# Altium project BRZ_LightLink_V2.PrjPcb
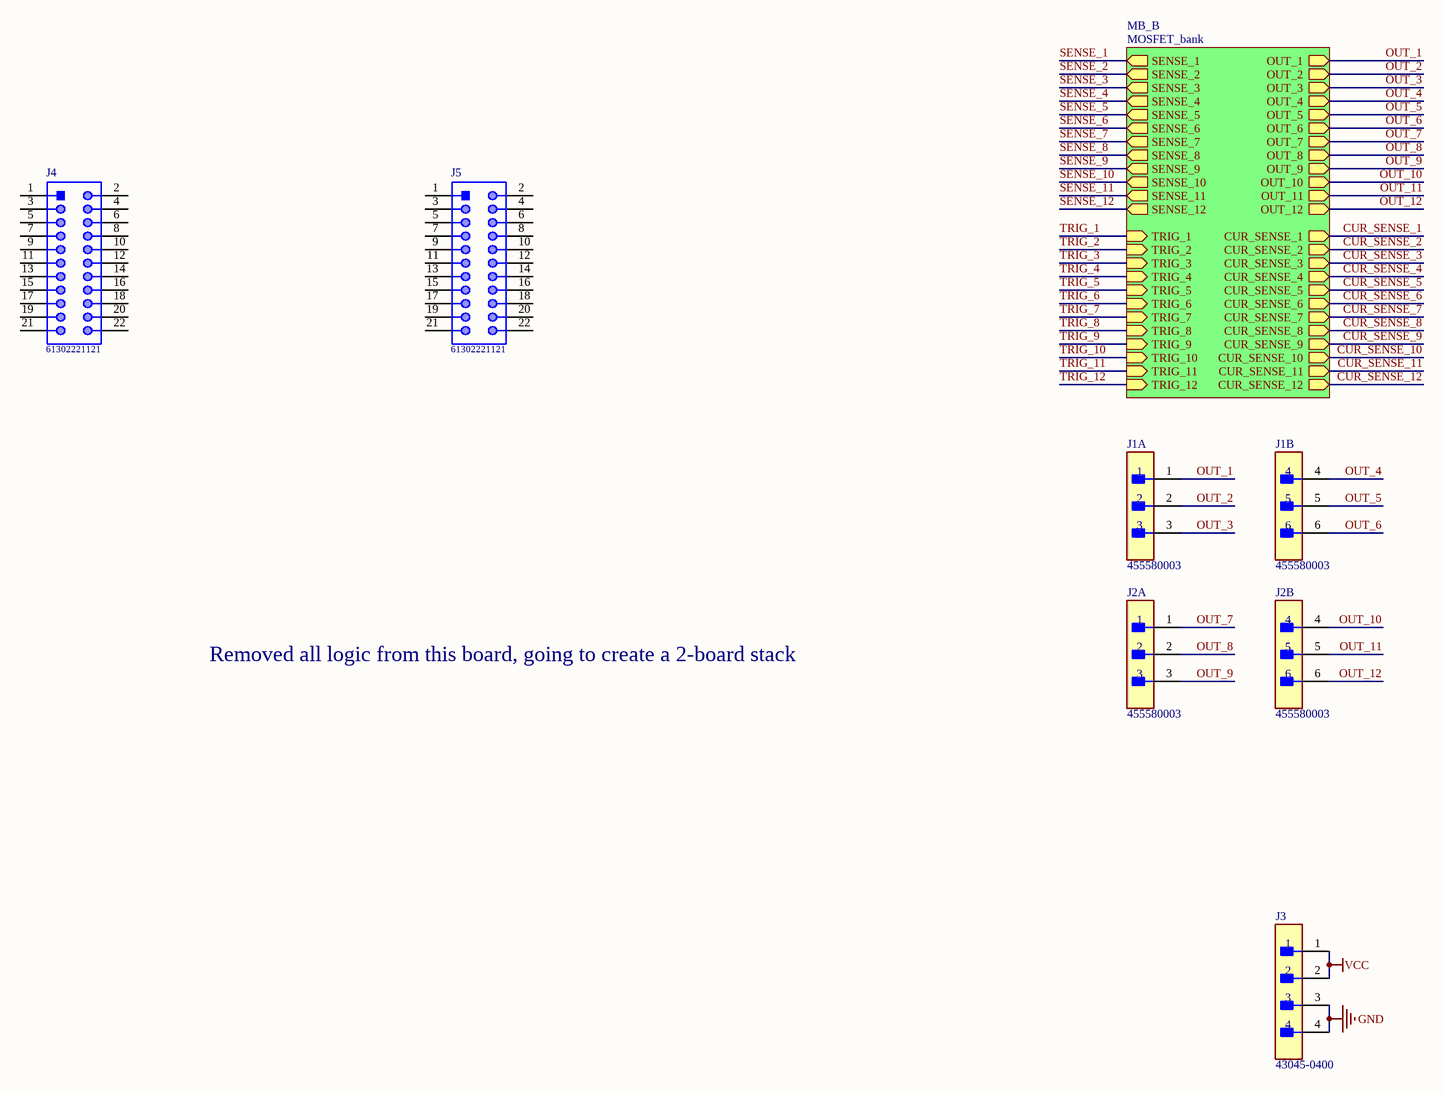
[diagram p0: LightLinkV2.SchDoc]
3 sheets, 269 parts. Net scope: hierarchical (ports join the sheet entries above them; power ports are global).
Board file: LightLinkV2.PcbDoc
Sheets:
  LightLinkV2.SchDoc
    MB_B = MOSFET_bank.SchDoc
      M = MOSFET.SchDoc
      M = MOSFET.SchDoc
      M = MOSFET.SchDoc
      M = MOSFET.SchDoc
      M = MOSFET.SchDoc
      M = MOSFET.SchDoc
      M = MOSFET.SchDoc
      M = MOSFET.SchDoc
      M = MOSFET.SchDoc
      M = MOSFET.SchDoc
      M = MOSFET.SchDoc
      M = MOSFET.SchDoc

## Sheet LightLinkV2.SchDoc
size B; SheetNumber: 1; SheetTotal: 3

### Parts
J1  455580003  [FP-455580003-MFG]  (parts A,B of 2)
J2  455580003  [FP-455580003-MFG]  (parts A,B of 2)
J3  43045-0400  [FP-43045-0400-MFG]
J4  61302221121  [61302221121]
J5  61302221121  [61302221121]

### Sub-sheets
MB_B = MOSFET_bank: SENSE_1 (out), SENSE_2 (out), SENSE_3 (out), SENSE_4 (out), TRIG_1 (in), OUT_1 (out), TRIG_2 (in), OUT_2 (out), TRIG_3 (in), OUT_3 (out), TRIG_4 (in), OUT_4 (out), SENSE_5 (out), SENSE_6 (out), SENSE_7 (out), SENSE_8 (out), TRIG_5 (in), OUT_5 (out), TRIG_6 (in), OUT_6 (out), TRIG_7 (in), OUT_7 (out), TRIG_8 (in), OUT_8 (out), SENSE_9 (out), SENSE_10 (out), SENSE_11 (out), SENSE_12 (out), TRIG_9 (in), OUT_9 (out), TRIG_10 (in), OUT_10 (out), TRIG_11 (in), OUT_11 (out), TRIG_12 (in), OUT_12 (out), CUR_SENSE_1 (out), CUR_SENSE_2 (out), CUR_SENSE_3 (out), CUR_SENSE_4 (out), CUR_SENSE_5 (out), CUR_SENSE_6 (out), CUR_SENSE_12 (out), CUR_SENSE_11 (out), CUR_SENSE_10 (out), CUR_SENSE_9 (out), CUR_SENSE_8 (out), CUR_SENSE_7 (out)

### Nets
GND: J3.3 J3.4
VCC: J3.1 J3.2
OUT_1: J1.1 ; sheet MB_B/OUT_1
OUT_2: J1.2 ; sheet MB_B/OUT_2
OUT_3: J1.3 ; sheet MB_B/OUT_3
OUT_4: J1.4 ; sheet MB_B/OUT_4
OUT_5: J1.5 ; sheet MB_B/OUT_5
OUT_6: J1.6 ; sheet MB_B/OUT_6
OUT_7: J2.1 ; sheet MB_B/OUT_7
OUT_8: J2.2 ; sheet MB_B/OUT_8
OUT_9: J2.3 ; sheet MB_B/OUT_9
OUT_10: J2.4 ; sheet MB_B/OUT_10
OUT_11: J2.5 ; sheet MB_B/OUT_11
OUT_12: J2.6 ; sheet MB_B/OUT_12

Not connected (* = marked no-connect by the designer): J4 1 2 3 4 5 6 7 8 9 10 11 12 13 14 15 16 17 18 19 20 21 22; J5 1 2 3 4 5 6 7 8 9 10 11 12 13 14 15 16 17 18 19 20 21 22

### Notes on the sheet
- Removed all logic from this board, going to create a 2-board stack

### Library data of the parts
J1 J2 = CMP-04776-000024-1: CONN HEADER R/A 6POS 4.2MM; Manufacturer: Molex; Standoff Height: 0.4mm; Conn Orientation: Right Angle; Number Of Contacts: 6; Conn Gender: Male; Voltage Rating: 600V; Current Rating: 8A; Footprint Url: https://www.molex.com/pdm_docs/sd/455580003_sd.pdf; Number Of Rows: 2; Lead Free: Yes; Digikey Description: CONN HEADER R/A 6POS 4.2MM; ComponentLink2URL: https://www.molex.com/webdocs/datasheets/pdf/en-us/0455580003_PCB_HEADERS.pdf; Octopart: https://octopart.com/45558-0003-molex-7672845; Package: 0; Device Class L3: unset; ComponentLink2Description: Datasheet; Device Class L2: Headers and Wire Housings; Category: Conn; Contact Material: Tin,Nickel; Mouser Description: Conn Power HDR 6 POS 4.2mm Solder ST Thru-Hole 6 Terminal 1 Port Mini-Fit Jr™ Tray; Manufacturer Part Number: 455580003; Pitch: 4.2mm; Device Class L1: Connectors; Temperature Range Low: -40°C; Temperature: -40°C to +105°C; RoHS: TRUE; Temperature Range High: +105°C; Height: 10.38mm; Automotive: No
J3 = CMP-04776-000002-1: CONN HEADER R/A 4POS 3MM; Manufacturer: Molex; Conn Gender: Male; Conn Orientation: Right Angle; Voltage Rating: 600V; Number Of Contacts: 4; Is Female: yes; Current Rating: 8.5A; ComponentLink2URL: https://www.molex.com/webdocs/datasheets/pdf/en-us/0430450400_PCB_HEADERS.pdf; Manufacturer Part Number: 43045-0400; Digikey Description: CONN HEADER R/A 4POS 3MM; Category: Conn; Temperature Range High: +105°C; Lead Free: Yes; Device Class L1: Connectors; Automotive: No; Temperature: -40°C to +105°C; Footprint Url: https://www.molex.com/pdm_docs/sd/430450400_sd.pdf; Height: 9.27mm; Number Of Rows: 2; Device Class L3: unset; Pitch: 3mm; Temperature Range Low: -40°C; Contact Material: Tin,Nickel; Octopart: https://octopart.com/43045-0400-molex-287063; RoHS: TRUE; ComponentLink2Description: Datasheet; Package: 43045-0400; Device Class L2: Headers and Wire Housings
J4 J5 = CMP-1502-01108-1: THT Vertical Pin Header WR-PHD, Pitch 2.54 mm, Dual Row, 22 pins; Manufacturer: Wurth Elektronik; Working Voltage: 250VAC; Pin Number: 22; Withstanding Voltage: 500VAC; Rated Current: 3A; Contact Resistance: 20mOhm; Gender: Male; Pitch: 2.54mm; Publisher: WurthElektronik; Part Number: 61302221121; Mounting Technology: THT; Row Number: Dual; Orientation: Vertical; Operating Temperature: -40to105degC; Manufacturer URL: http://www.we-online.de; Packaging: Bag; Datasheet URL: https://katalog.we-online.de/em/datasheet/6130xx21121.pdf; Package Reference: 61302221121

## Sheet MOSFET_bank.SchDoc
size A; SheetNumber: 2; SheetTotal: 4
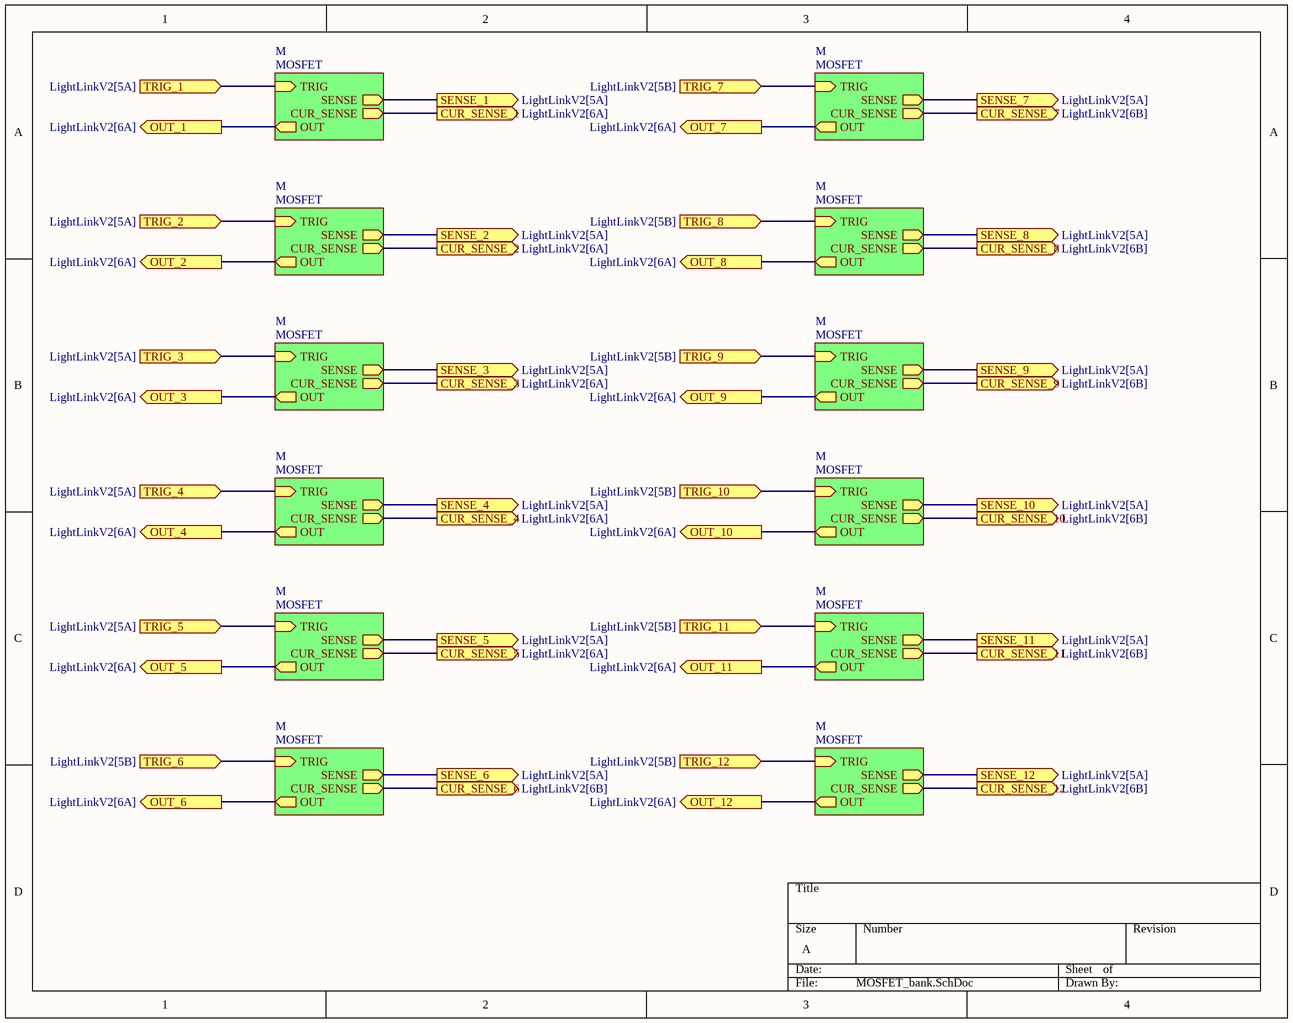
[diagram p1: MOSFET_bank.SchDoc]

### Sub-sheets
M = MOSFET: TRIG (in), OUT (out), SENSE (out), CUR_SENSE (out)
M = MOSFET: TRIG (in), OUT (out), SENSE (out), CUR_SENSE (out)
M = MOSFET: TRIG (in), OUT (out), SENSE (out), CUR_SENSE (out)
M = MOSFET: TRIG (in), OUT (out), SENSE (out), CUR_SENSE (out)
M = MOSFET: TRIG (in), OUT (out), SENSE (out), CUR_SENSE (out)
M = MOSFET: TRIG (in), OUT (out), SENSE (out), CUR_SENSE (out)
M = MOSFET: TRIG (in), OUT (out), SENSE (out), CUR_SENSE (out)
M = MOSFET: TRIG (in), OUT (out), SENSE (out), CUR_SENSE (out)
M = MOSFET: TRIG (in), OUT (out), SENSE (out), CUR_SENSE (out)
M = MOSFET: TRIG (in), OUT (out), SENSE (out), CUR_SENSE (out)
M = MOSFET: TRIG (in), OUT (out), SENSE (out), CUR_SENSE (out)
M = MOSFET: TRIG (in), OUT (out), SENSE (out), CUR_SENSE (out)

### Ports
CUR_SENSE_1 (out, see LightLinkV2[6A]), CUR_SENSE_2 (out, see LightLinkV2[6A]), CUR_SENSE_3 (out, see LightLinkV2[6A]), CUR_SENSE_4 (out, see LightLinkV2[6A]), CUR_SENSE_5 (out, see LightLinkV2[6A]), CUR_SENSE_6 (out, see LightLinkV2[6B]), CUR_SENSE_7 (out, see LightLinkV2[6B]), CUR_SENSE_8 (out, see LightLinkV2[6B]), CUR_SENSE_9 (out, see LightLinkV2[6B]), CUR_SENSE_10 (out, see LightLinkV2[6B]), CUR_SENSE_11 (out, see LightLinkV2[6B]), CUR_SENSE_12 (out, see LightLinkV2[6B]), OUT_1 (out, see LightLinkV2[6A]), OUT_2 (out, see LightLinkV2[6A]), OUT_3 (out, see LightLinkV2[6A]), OUT_4 (out, see LightLinkV2[6A]), OUT_5 (out, see LightLinkV2[6A]), OUT_6 (out, see LightLinkV2[6A]), OUT_7 (out, see LightLinkV2[6A]), OUT_8 (out, see LightLinkV2[6A]), OUT_9 (out, see LightLinkV2[6A]), OUT_10 (out, see LightLinkV2[6A]), OUT_11 (out, see LightLinkV2[6A]), OUT_12 (out, see LightLinkV2[6A]), SENSE_1 (out, see LightLinkV2[5A]), SENSE_2 (out, see LightLinkV2[5A]), SENSE_3 (out, see LightLinkV2[5A]), SENSE_4 (out, see LightLinkV2[5A]), SENSE_5 (out, see LightLinkV2[5A]), SENSE_6 (out, see LightLinkV2[5A]), SENSE_7 (out, see LightLinkV2[5A]), SENSE_8 (out, see LightLinkV2[5A]), SENSE_9 (out, see LightLinkV2[5A]), SENSE_10 (out, see LightLinkV2[5A]), SENSE_11 (out, see LightLinkV2[5A]), SENSE_12 (out, see LightLinkV2[5A]), TRIG_1 (in, see LightLinkV2[5A]), TRIG_2 (in, see LightLinkV2[5A]), TRIG_3 (in, see LightLinkV2[5A]), TRIG_4 (in, see LightLinkV2[5A]), TRIG_5 (in, see LightLinkV2[5A]), TRIG_6 (in, see LightLinkV2[5B]), TRIG_7 (in, see LightLinkV2[5B]), TRIG_8 (in, see LightLinkV2[5B]), TRIG_9 (in, see LightLinkV2[5B]), TRIG_10 (in, see LightLinkV2[5B]), TRIG_11 (in, see LightLinkV2[5B]), TRIG_12 (in, see LightLinkV2[5B])

### Nets
CUR_SENSE_1: port CUR_SENSE_1, sheet M/CUR_SENSE
CUR_SENSE_2: port CUR_SENSE_2, sheet M/CUR_SENSE
CUR_SENSE_3: port CUR_SENSE_3, sheet M/CUR_SENSE
CUR_SENSE_4: port CUR_SENSE_4, sheet M/CUR_SENSE
CUR_SENSE_5: port CUR_SENSE_5, sheet M/CUR_SENSE
CUR_SENSE_6: port CUR_SENSE_6, sheet M/CUR_SENSE
CUR_SENSE_7: port CUR_SENSE_7, sheet M/CUR_SENSE
CUR_SENSE_8: port CUR_SENSE_8, sheet M/CUR_SENSE
CUR_SENSE_9: port CUR_SENSE_9, sheet M/CUR_SENSE
CUR_SENSE_10: port CUR_SENSE_10, sheet M/CUR_SENSE
CUR_SENSE_11: port CUR_SENSE_11, sheet M/CUR_SENSE
CUR_SENSE_12: port CUR_SENSE_12, sheet M/CUR_SENSE
OUT_1: port OUT_1, sheet M/OUT
OUT_2: port OUT_2, sheet M/OUT
OUT_3: port OUT_3, sheet M/OUT
OUT_4: port OUT_4, sheet M/OUT
OUT_5: port OUT_5, sheet M/OUT
OUT_6: port OUT_6, sheet M/OUT
OUT_7: port OUT_7, sheet M/OUT
OUT_8: port OUT_8, sheet M/OUT
OUT_9: port OUT_9, sheet M/OUT
OUT_10: port OUT_10, sheet M/OUT
OUT_11: port OUT_11, sheet M/OUT
OUT_12: port OUT_12, sheet M/OUT
SENSE_1: port SENSE_1, sheet M/SENSE
SENSE_2: port SENSE_2, sheet M/SENSE
SENSE_3: port SENSE_3, sheet M/SENSE
SENSE_4: port SENSE_4, sheet M/SENSE
SENSE_5: port SENSE_5, sheet M/SENSE
SENSE_6: port SENSE_6, sheet M/SENSE
SENSE_7: port SENSE_7, sheet M/SENSE
SENSE_8: port SENSE_8, sheet M/SENSE
SENSE_9: port SENSE_9, sheet M/SENSE
SENSE_10: port SENSE_10, sheet M/SENSE
SENSE_11: port SENSE_11, sheet M/SENSE
SENSE_12: port SENSE_12, sheet M/SENSE
TRIG_1: port TRIG_1, sheet M/TRIG
TRIG_2: port TRIG_2, sheet M/TRIG
TRIG_3: port TRIG_3, sheet M/TRIG
TRIG_4: port TRIG_4, sheet M/TRIG
TRIG_5: port TRIG_5, sheet M/TRIG
TRIG_6: port TRIG_6, sheet M/TRIG
TRIG_7: port TRIG_7, sheet M/TRIG
TRIG_8: port TRIG_8, sheet M/TRIG
TRIG_9: port TRIG_9, sheet M/TRIG
TRIG_10: port TRIG_10, sheet M/TRIG
TRIG_11: port TRIG_11, sheet M/TRIG
TRIG_12: port TRIG_12, sheet M/TRIG

## Sheet MOSFET.SchDoc
size A4; SheetNumber: 3; SheetTotal: 3
Used 12 times, as channels MB_B/M, MB_B/M, MB_B/M, MB_B/M, MB_B/M, MB_B/M, MB_B/M, MB_B/M, MB_B/M, MB_B/M, MB_B/M, MB_B/M. Parts and nets are listed once, with the designators drawn on the sheet.
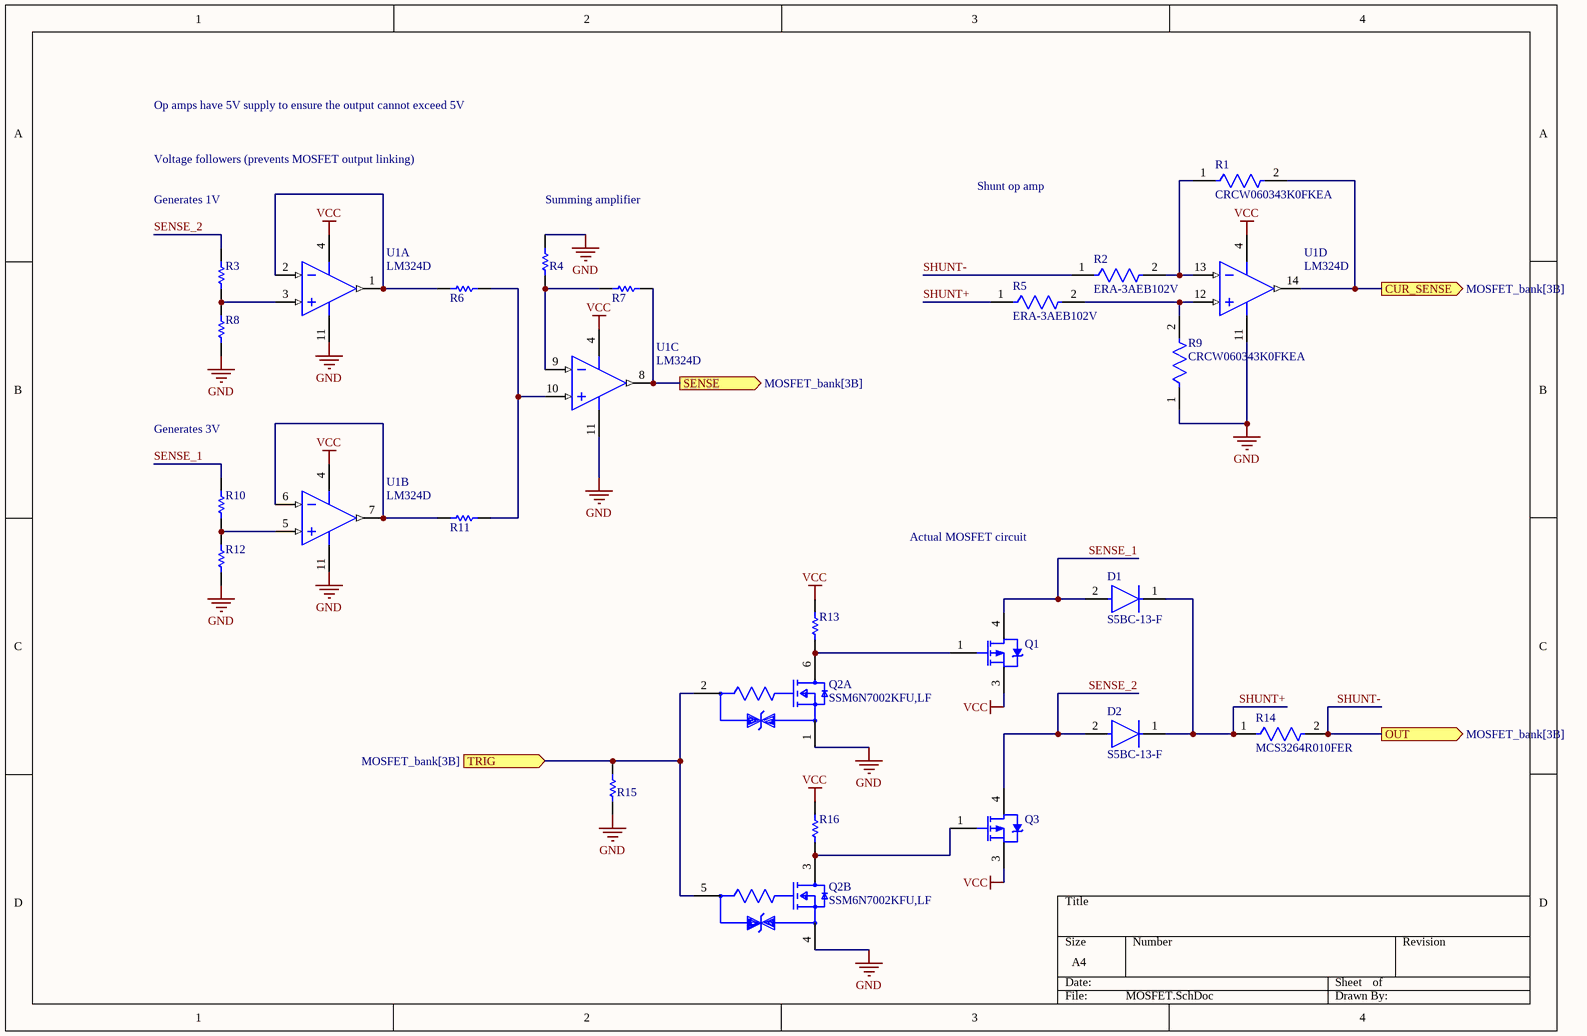
[diagram p2: MOSFET.SchDoc]

### Parts
D1  S5BC-13-F  [FP-SMC-MFG]
D2  S5BC-13-F  [FP-SMC-MFG]
Q1  NTD25P03LT4G  [ONSC-DPAK-3-369C-01_V]  (value not drawn)
Q2  SSM6N7002KFU,LF  [FP-SSOP6-P-0_65A-MFG]  (parts A,B of 2)
Q3  NTD25P03LT4G  [ONSC-DPAK-3-369C-01_V]  (value not drawn)
R1  CRCW060343K0FKEA  [FP-CRCW0603-e3-IPC_A]
R2  ERA-3AEB102V  [FP-ERA3A-IPC_C]
R3  ERJ3EKF1002V  [RESC1609X55X30LL15T15]  (value not drawn)
R4  ERJ3EKF1002V  [RESC1609X55X30LL15T15]  (value not drawn)
R5  ERA-3AEB102V  [FP-ERA3A-IPC_C]
R6  ERJ3EKF1002V  [RESC1609X55X30LL15T15]  (value not drawn)
R7  ERJ3EKF1002V  [RESC1609X55X30LL15T15]  (value not drawn)
R8  ERA-3AEB751V  [RESC1608X55X30ML20T20]  (value not drawn)
R9  CRCW060343K0FKEA  [FP-CRCW0603-e3-IPC_A]
R10  ERJ3EKF1002V  [RESC1609X55X30LL15T15]  (value not drawn)
R11  ERJ3EKF1002V  [RESC1609X55X30LL15T15]  (value not drawn)
R12  ERA3AEB242V  [RESC1608X55X30NL20T20]  (value not drawn)
R13  ERJ3EKF1002V  [RESC1609X55X30LL15T15]  (value not drawn)
R14  MCS3264R010FER  [FP-MCS3264-MFG]
R15  ERJ3EKF1002V  [RESC1609X55X30LL15T15]  (value not drawn)
R16  ERJ3EKF1002V  [RESC1609X55X30LL15T15]  (value not drawn)
U1  LM324D  [D0014A_L]  (parts A,B,C,D of 4)

### Ports
CUR_SENSE (out, see MOSFET_bank[3B]), OUT (out, see MOSFET_bank[3B]), SENSE (out, see MOSFET_bank[3B]), TRIG (in, see MOSFET_bank[3B])

### Nets
GND: Q2.1(Source1) Q2.4(Source2) R4.1 R8.1 R9.1 R12.1 R15.2 U1.11(GND)
VCC: Q1.3(S) Q3.3(S) R13.2 R16.2 U1.4(VCC)
CUR_SENSE: R1.2 U1.14(4OUT) ; port CUR_SENSE
SENSE: R7.1 U1.8(3OUT) ; port SENSE
SENSE_1: D1.2(A) Q1.4(D) R10.2
SENSE_2: D2.2(A) Q3.4(D) R3.2
SHUNT+: D1.1(C) D2.1(C) R5.1 R14.1
SHUNT-: R2.1 R14.2 ; port OUT
TRIG: Q2.2(Gate1) Q2.5(Gate2) R15.1 ; port TRIG
NetQ1_1: Q1.1(G) Q2.6(Drain1) R13.1
NetQ2_3: Q2.3(Drain2) Q3.1(G) R16.1
NetR1_1: R1.1 R2.2 U1.13(4IN-)
NetR3_1: R3.1 R8.2 U1.3(1IN+)
NetR4_2: R4.2 R7.2 U1.9(3IN-)
NetR5_2: R5.2 R9.2 U1.12(4IN+)
NetR6_1: R6.1 R11.1 U1.10(3IN+)
NetR6_2: R6.2 U1.1(1OUT) U1.2(1IN-)
NetR10_1: R10.1 R12.2 U1.5(2IN+)
NetR11_2: R11.2 U1.6(2IN-) U1.7(2OUT)

### Channels
MB_B/M: designators end in _M12; ports CUR_SENSE=CUR_SENSE_1 OUT=OUT_1 SENSE=SENSE_1 TRIG=TRIG_1
MB_B/M: designators end in _M11; ports CUR_SENSE=CUR_SENSE_2 OUT=OUT_2 SENSE=SENSE_2 TRIG=TRIG_2
MB_B/M: designators end in _M10; ports CUR_SENSE=CUR_SENSE_3 OUT=OUT_3 SENSE=SENSE_3 TRIG=TRIG_3
MB_B/M: designators end in _M9; ports CUR_SENSE=CUR_SENSE_4 OUT=OUT_4 SENSE=SENSE_4 TRIG=TRIG_4
MB_B/M: designators end in _M8; ports CUR_SENSE=CUR_SENSE_5 OUT=OUT_5 SENSE=SENSE_5 TRIG=TRIG_5
MB_B/M: designators end in _M7; ports CUR_SENSE=CUR_SENSE_6 OUT=OUT_6 SENSE=SENSE_6 TRIG=TRIG_6
MB_B/M: designators end in _M6; ports CUR_SENSE=CUR_SENSE_7 OUT=OUT_7 SENSE=SENSE_7 TRIG=TRIG_7
MB_B/M: designators end in _M5; ports CUR_SENSE=CUR_SENSE_8 OUT=OUT_8 SENSE=SENSE_8 TRIG=TRIG_8
MB_B/M: designators end in _M4; ports CUR_SENSE=CUR_SENSE_9 OUT=OUT_9 SENSE=SENSE_9 TRIG=TRIG_9
MB_B/M: designators end in _M3; ports CUR_SENSE=CUR_SENSE_10 OUT=OUT_10 SENSE=SENSE_10 TRIG=TRIG_10
MB_B/M: designators end in _M2; ports CUR_SENSE=CUR_SENSE_11 OUT=OUT_11 SENSE=SENSE_11 TRIG=TRIG_11
MB_B/M: designators end in _M1; ports CUR_SENSE=CUR_SENSE_12 OUT=OUT_12 SENSE=SENSE_12 TRIG=TRIG_12

### Notes on the sheet
- Op amps have 5V supply to ensure the output cannot exceed 5V
- Voltage followers (prevents MOSFET output linking)
- Generates 1V
- (near R4) Summing amplifier
- Shunt op amp
- Generates 3V
- Actual MOSFET circuit

### Library data of the parts
D1 D2 = CMP-2000-07025-2: DIODE GEN PURP 100V 5A SMC; Manufacturer: Diodes Inc.; Peak Reverse Current: 10uA; Max Junction Temp: +150°C; Max Surge Forward Current: 100A; Value: 40pF; Standoff Height: 0.1mm; Octopart: https://octopart.com/s5bc-13-f-diodes+inc.-333396; Category: Diode; Manufacturer Part Number: S5BC-13-F; RoHS: TRUE; Footprint Url: https://www.diodes.com/assets/Package-Files/SMC.pdf; Device Class L1: Discrete Semiconductors; Temperature Range Low: -65°C; Lead Free: Yes; ComponentLink2URL: https://www.diodes.com/assets/Datasheets/ds16007.pdf; Package: SMC; Max Repetitive Reverse Voltage: 100V; Device Class L3: Rectifier Diodes; Automotive: No; Forward Current: 5A; Temperature: -65°C to +150°C; Digikey Description: DIODE GEN PURP 100V 5A SMC; Reverse Voltage: 100V; Capacitance: 40pF; Mouser Description: Rectifiers 100V 5A; ComponentLink2Description: Datasheet; Device Class L2: Diodes; Temperature Range High: +150°C; Height: 2.5mm
Q1 Q3 = CMP-1058-00409-1: Power MOSFET, -25 A, -30 V, Logic Level P-Channel, 3-Pin DPAK, Pb-Free, Tape and Reel; Manufacturer: On Semiconductor; Coss Typ (pF): 290; Crss Typ (pF): 105; V(BR)DSS Min (V): 30; VGS Max (V): 15; PD Max (W): 75; Ciss Typ (pF): 900; ID Max (A): 25; Qrr Typ (nC): 35; Configuration: Single; Channel Polarity: P Channel; VGS(th) Max (V): 2; Mounting Technology: Surface Mount; ComponentLink2Description: Datasheet; ComponentLink3URL: http://www.onsemi.cn/pub_link/Collateral/369C.PDF; ComponentLink1Description: Manufacturer URL; ComponentLink3Description: Package Specification; Packing: Tape and Reel; DatasheetVersion: Rev. 4; PackageDescription: 3-Pin Flange Mount, Body 6.54 x 6.095 mm, Pitch 2.29 mm; ComponentLink2URL: http://www.onsemi.cn/pub_link/Collateral/NTD25P03L-D.PDF; PackageReference: DPAK-3-369C-01; Package Type: DPAK-3; PackageVersion: Rev. E, 02/2014; ComponentLink1URL: http://www.onsemi.com/; RoHS: Pb-Free; PartNumber: NTD25P03LT4G
Q2 = CMP-35916-000009-1: MOSFET 2N-CH 60V 0.3A; Input Capacitance: 40pF; Continuous Drain Current (ID): 300mA; Max Power Dissipation: 285mW; FET Type: 2 N-Channel; Rds On Max: 1.5R; Mount: Surface Mount; Drain to Source Voltage (Vdss): 60V; Packaging: Tape and Reel
R1 R9 = CMP-2000-03352-2: RES Thick Film, 43kΩ, 1%, 0.1W, 100ppm/°C, 0603; Voltage Rating: 75V; Power Rating: 100mW; Resistance: 43kR; Height: 0.45mm; Contact Plating: Tin; Depth: 0.85mm; Case Code (Metric): 1608; Min Operating Temperature: -55°C; Length: 1.55mm; Voltage Rating (DC): 75V; Tolerance: 1%; Case Code (Imperial): 0603; Features: Automotive AEC-Q200; Number of Pins: 2; Lead Free: Lead Free; Number of Terminations: 2; Temperature Coefficient: 100ppm/°C; Max Power Dissipation: 100mW; Package Quantity: 10; Weight: 7.1E-05oz; Military Standard: Not; Termination: SMD/SMT; Max Operating Temperature: 155°C; Radiation Hardening: No; Width: 0.033inch; Mount: Surface Mount; Composition: Thick Film; Case/Package: 0603; Packaging: Tape and Reel
R2 R5 = CMP-2000-00873-2: RES SMD 1K OHM 0.1% 1/10W 0603; Temperature Coefficient: 25ppm/°C; Voltage Rating: 75V; Max Power Dissipation: 100mW; Resistance: 1kR; Technology: METAL FILM; Number of Pins: 2; Packaging: Tape and Reel; Case Code (Imperial): 0603; Case Code (Metric): 1608; Min Operating Temperature: -55°C; REACH SVHC: No SVHC; Length: 1.6mm; Termination: SMD/SMT; Depth: 0.8mm; Resistance Tolerance: 0.1%; Number of Terminations: 2; Width: 0.8mm; Military Standard: Not; Tolerance: 0.1%; Package Quantity: 5000; Contact Plating: Tin; Height: 0.45mm; Construction: Rectangular; Case/Package: 0603; Max Operating Temperature: 155°C; Resistor Type: Thin Film; Series: ERA-3A; Size Code: 0603; RoHS Compliant: Yes; Mount: Surface Mount; Radiation Hardening: No; Power Rating: 100mW
R3 R4 R6 R7 R10 R11 R13 R15 R16 = CMP-1012-00623-3: Chip Resistor, 10 KOhm, +/- 1%, 0.1 W, -55 to 155 degC, 0603 (1608 Metric), RoHS, Tape and Reel; Manufacturer: Panasonic; Voltage Rating: 75V; Case\/Package: 0603; Power Rating: 100mW; Resistance: 10KOhm; Temperature Coefficient: 100ppm\/degreesC; Number of Pins: 2; Package Reference: 603; Depth: 0.8mm; Mount: SurfaceMount; Package Description: 2-Pin Surface Mount Device, Body 1.6 x 0.85 mm; Datasheet Version: 02/2017; Length: 1.6mm; Lead Free: LeadFree; Height: 0.45mm; Number of Terminations: 2; Max Power Dissipation: 100mW; Min Operating Temperature: -55degC; Datasheet URL: https://industrial.panasonic.com/cdbs/www-data/pdf/RDA0000/AOA0000C304.pdf; Termination: SMD/SMT; Case Code (Metric): 1608; Case Code (Imperial): 0603; Tolerance: 1%; Max Operating Temperature: 155degC; RoHSCompliant: true; Voltage Rating (DC): 75V; Radiation Hardening: No; Packaging: TapeandReel; Composition: ThickFilm; Mounting Technology: SurfaceMount; Manufacturer URL: http://www.panasonic.com/; Width: 0.031inch; REACH SVHC: NoSVHC; Contact Plating: Tin; Military Standard: Not; Package Quantity: 1
R8 = CMP-2000-00122-1: Manufacturer: Panasonic; Part Number: ERA-3AEB751V
R12 = CMP-2000-00965-1: Manufacturer: Panasonic; Part Number: ERA3AEB242V
R14 = CMP-33361-000012-1: RES SMD 10 MOHM 1% 2W 3264; Temperature Coefficient: 50ppm/°C; Resistance: 10mR; Voltage Rating: 220mV; Case/Package: 2512; Military Standard: Not; Max Operating Temperature: 150°C; Height: 0.024inch; Package Quantity: 1; Case Code (Imperial): 2512; Number of Terminations: 2; Features: Flame Retardant Coating; Width: 0.126inch; Tolerance: 1%; Composition: Metal Element; Number of Pins: 2; Packaging: Tape and Reel; Depth: 3.2mm; Termination: SMD/SMT; Min Operating Temperature: -55°C; Power Rating: 2W; Case Code (Metric): 6432; Max Power Dissipation: 2W; Mount: Surface Mount; Length: 6.4mm
U1 = CMP-2000-06547-1: Quadruple Operational Amplifier, 0.5 V/us, 1.2 MHz, 3 to 32 V, 0 to 70 degC, 14-Pin SOIC (D), Green (RoHS & no Sb/Br), Tube; Manufacturer: Texas Instruments; Unity Gain Bandwidth Product: 1.2MHz; Input Offset Voltage: 7mV; Dual Supply Voltage (Max): ±16V; Single Supply Voltage (Min): 3V; Single Supply Voltage (Max): 32V; Voltage Gain in dB: 100dB; Power Supply Requirement: Single/Dual; Input Bias Current: 250nA; Dual Supply Voltage (Min): ±1.5V; Single Supply Voltage (Typ): 5/9/12/15/18/24/28V; Dual Supply Voltage (Typ): ±3/±5/±9/±12/±15V; Number of  Elements: 4; Common Mode Rejection Ratio: 65dB; Datasheet Version: Rev. W, 03/2015; Technology: Bipolar; Shut Down Feature: No; Package Reference: D0014A; Type: GeneralPurposeAmplifier; Pin Count: 14; Package Type: SOIC; Rail/Rail I/O Type: No; Manufacturer URL: http://www.ti.com/; Package Description: 14-Pin Small Outline Integrated Circuit, Body 8.65 x 3.9 mm, Pitch 1.27 mm; Operating Temperature Classification: Commercial; Datasheet URL: http://www.ti.com/lit/ds/symlink/lm324.pdf; Slew Rate: 0.5V/us; Package URL: http://www.ti.com/lit/ml/mpds177g/mpds177g.pdf; Mounting: SurfaceMount; Packaging: Rail/Tube; Mounting Technology: SurfaceMount; Operating Temp Range: 0Cto70C

## Nets that join several sheets
GND: LightLinkV2 (J3.3 J3.4), MB_B/M (8 pins), MB_B/M (8 pins), MB_B/M (8 pins), MB_B/M (8 pins), MB_B/M (8 pins), MB_B/M (8 pins), MB_B/M (8 pins), MB_B/M (8 pins), MB_B/M (8 pins), MB_B/M (8 pins), MB_B/M (8 pins), MB_B/M (8 pins)
VCC: LightLinkV2 (J3.1 J3.2), MB_B/M (5 pins), MB_B/M (5 pins), MB_B/M (5 pins), MB_B/M (5 pins), MB_B/M (5 pins), MB_B/M (5 pins), MB_B/M (5 pins), MB_B/M (5 pins), MB_B/M (5 pins), MB_B/M (5 pins), MB_B/M (5 pins), MB_B/M (5 pins)
OUT_1: LightLinkV2 (J1.1), MB_B/M (R2_M12.1 R14_M12.2)
OUT_2: LightLinkV2 (J1.2), MB_B/M (R2_M11.1 R14_M11.2)
OUT_3: LightLinkV2 (J1.3), MB_B/M (R2_M10.1 R14_M10.2)
OUT_4: LightLinkV2 (J1.4), MB_B/M (R2_M9.1 R14_M9.2)
OUT_5: LightLinkV2 (J1.5), MB_B/M (R2_M8.1 R14_M8.2)
OUT_6: LightLinkV2 (J1.6), MB_B/M (R2_M7.1 R14_M7.2)
OUT_7: LightLinkV2 (J2.1), MB_B/M (R2_M6.1 R14_M6.2)
OUT_8: LightLinkV2 (J2.2), MB_B/M (R2_M5.1 R14_M5.2)
OUT_9: LightLinkV2 (J2.3), MB_B/M (R2_M4.1 R14_M4.2)
OUT_10: LightLinkV2 (J2.4), MB_B/M (R2_M3.1 R14_M3.2)
OUT_11: LightLinkV2 (J2.5), MB_B/M (R2_M2.1 R14_M2.2)
OUT_12: LightLinkV2 (J2.6), MB_B/M (R2_M1.1 R14_M1.2)